# EAGLE design base_backup.1 (EAGLE 6.5.0)
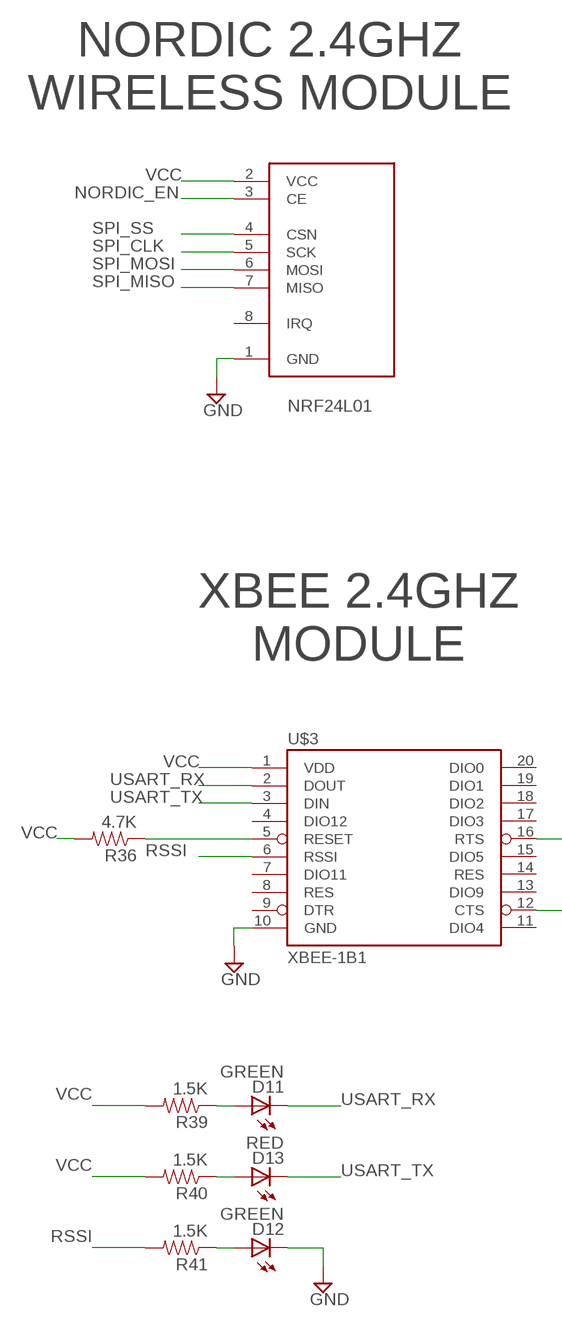
[diagram p0: schematic, sheet 1, part 1 of 2]
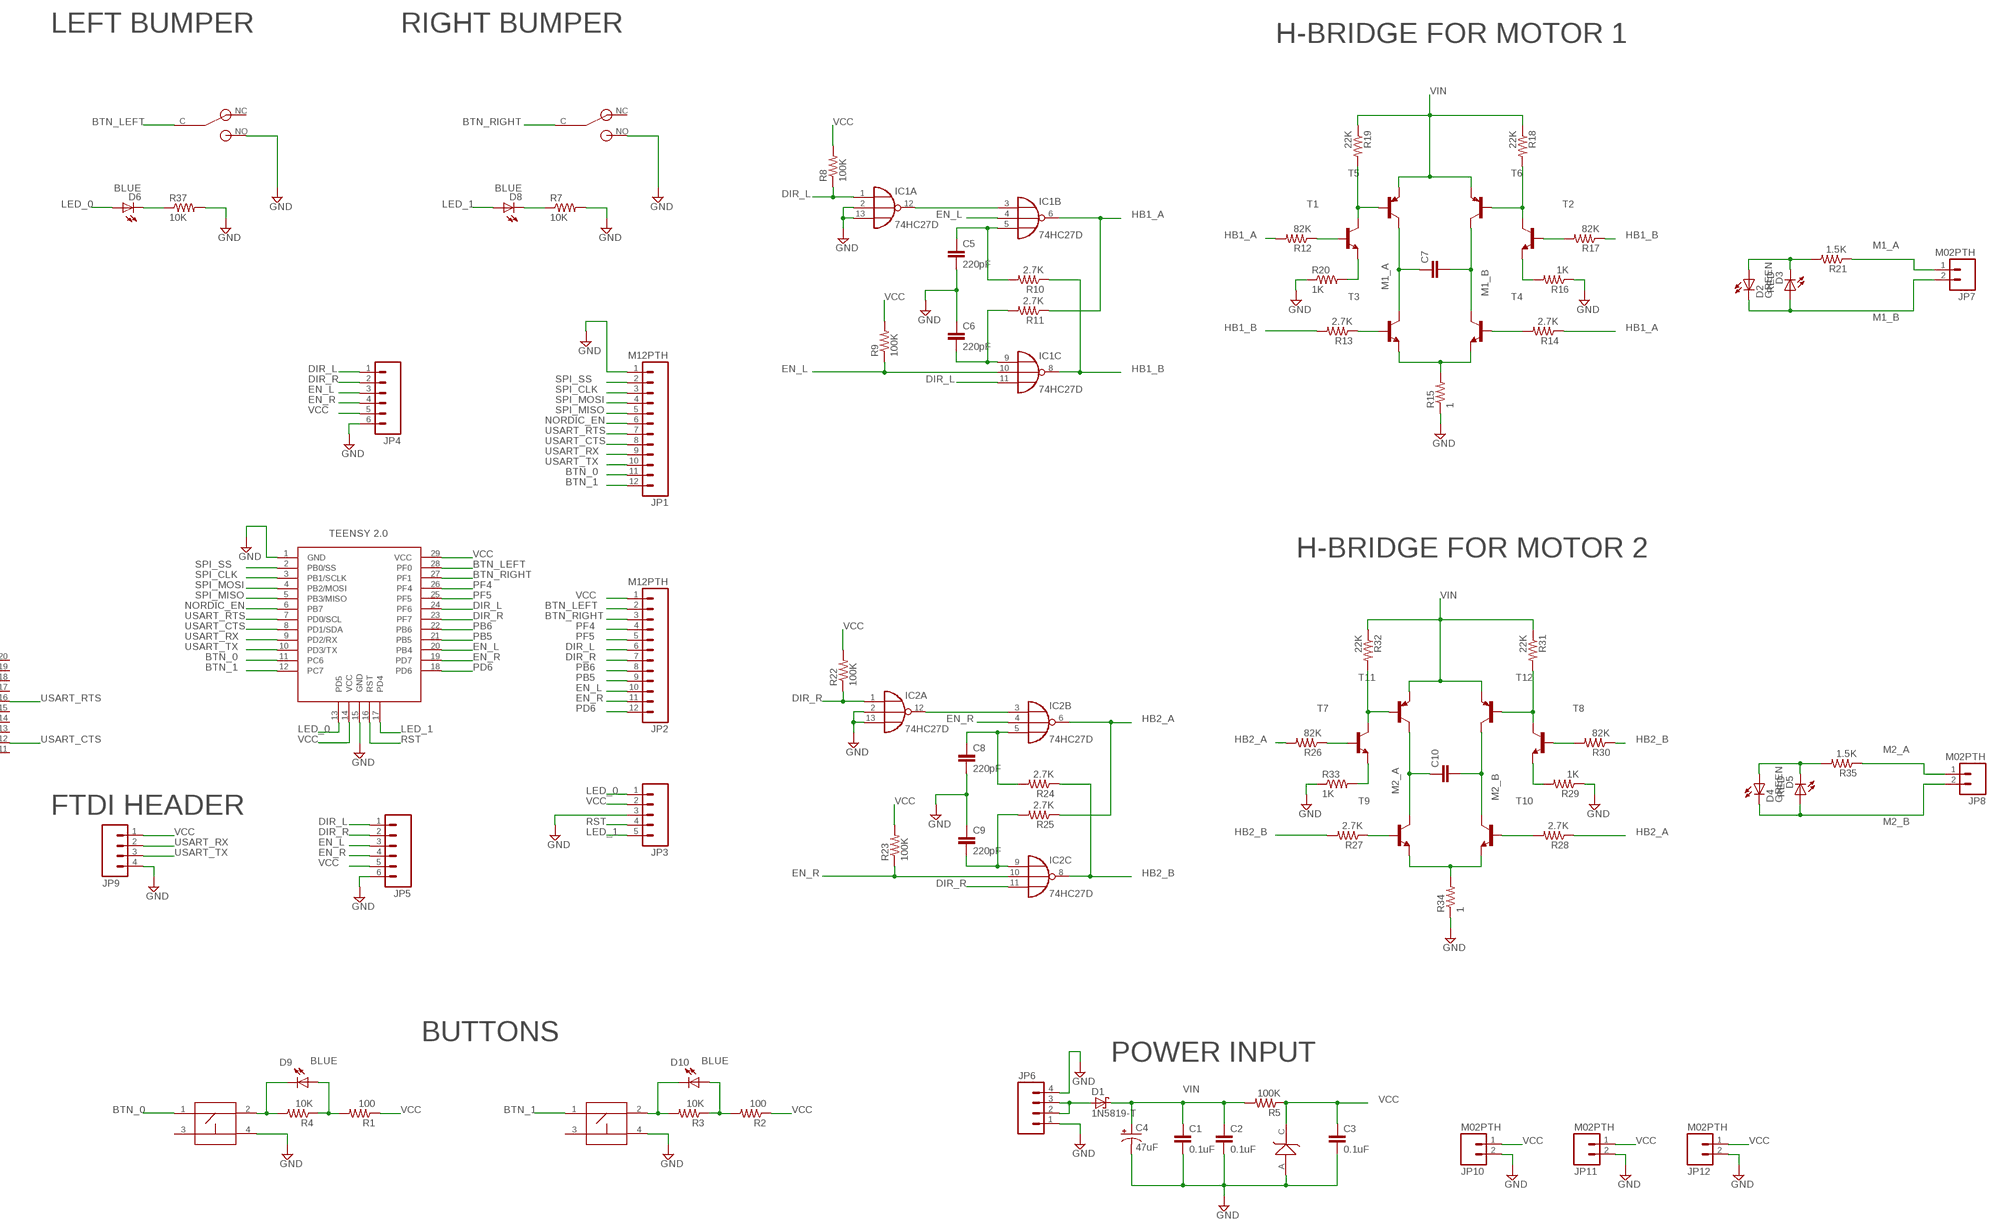
[diagram p1: schematic, sheet 1, part 2 of 2]

## Parts
C1  0.1uF  CAP0603-CAP  [0603-CAP]
C2  0.1uF  CAP0603-CAP  [0603-CAP]
C3  0.1uF  CAP0603-CAP  [0603-CAP]
C4  47uF  CAP_POLC  [PANASONIC_C]
C5  220pF  CAP0603-CAP  [0603-CAP]
C6  220pF  CAP0603-CAP  [0603-CAP]
C7  CAP0603-CAP  [0603-CAP]
C8  220pF  CAP0603-CAP  [0603-CAP]
C9  220pF  CAP0603-CAP  [0603-CAP]
C10  CAP0603-CAP  [0603-CAP]
D1  1N5819-T  [DO41-7.6]
D2  GREEN  LED-GREEN0603  [LED-0603]
D3  RED  LED-RED0603  [LED-0603]
D4  GREEN  LED-GREEN0603  [LED-0603]
D5  RED  LED-RED0603  [LED-0603]
D6  BLUE  LED-BLUE0603  [LED-0603]
D7  1N5819  [DO41-7.6]
D8  BLUE  LED-BLUE0603  [LED-0603]
D9  BLUE  LED-BLUE0603  [LED-0603]
D10  BLUE  LED-BLUE0603  [LED-0603]
D11  GREEN  LED-GREEN0603  [LED-0603]
D12  GREEN  LED-GREEN0603  [LED-0603]
D13  RED  LED-RED0603  [LED-0603]
IC1  74HC27D  [SO14]
IC2  74HC27D  [SO14]
JP1  M12PTH  [1X12]
JP2  M12PTH  [1X12]
JP3  M05PTH  [1X05]
JP4  M06SIP  [1X06]
JP5  M06SIP  [1X06]
JP6  M04PTH  [1X04]
JP7  M02PTH  [1X02]
JP8  M02PTH  [1X02]
JP9  M04PTH  [1X04]
JP10  M02PTH  [1X02]
JP11  M02PTH  [1X02]
JP12  M02PTH  [1X02]
R1  100  RESISTOR0603  [0603-RES]
R2  100  RESISTOR0603  [0603-RES]
R3  10K  RESISTOR0603  [0603-RES]
R4  10K  RESISTOR0603  [0603-RES]
R5  100K  RESISTOR0603  [0603-RES]
R7  10K  RESISTOR0603  [0603-RES]
R8  100K  RESISTOR0603  [0603-RES]
R9  100K  RESISTOR0603  [0603-RES]
R10  2.7K  RESISTOR0603-RES  [0603-RES]
R11  2.7K  RESISTOR0603-RES  [0603-RES]
R12  82K  RESISTOR0603-RES  [0603-RES]
R13  2.7K  RESISTOR0603-RES  [0603-RES]
R14  2.7K  RESISTOR0603-RES  [0603-RES]
R15  1  RESISTOR0603-RES  [0603-RES]
R16  1K  RESISTOR0603-RES  [0603-RES]
R17  82K  RESISTOR0603-RES  [0603-RES]
R18  22K  RESISTOR0603-RES  [0603-RES]
R19  22K  RESISTOR0603-RES  [0603-RES]
R20  1K  RESISTOR0603-RES  [0603-RES]
R21  1.5K  RESISTOR0603-RES  [0603-RES]
R22  100K  RESISTOR0603  [0603-RES]
R23  100K  RESISTOR0603  [0603-RES]
R24  2.7K  RESISTOR0603-RES  [0603-RES]
R25  2.7K  RESISTOR0603-RES  [0603-RES]
R26  82K  RESISTOR0603-RES  [0603-RES]
R27  2.7K  RESISTOR0603-RES  [0603-RES]
R28  2.7K  RESISTOR0603-RES  [0603-RES]
R29  1K  RESISTOR0603-RES  [0603-RES]
R30  82K  RESISTOR0603-RES  [0603-RES]
R31  22K  RESISTOR0603-RES  [0603-RES]
R32  22K  RESISTOR0603-RES  [0603-RES]
R33  1K  RESISTOR0603-RES  [0603-RES]
R34  1  RESISTOR0603-RES  [0603-RES]
R35  1.5K  RESISTOR0603-RES  [0603-RES]
R36  4.7K  RESISTOR0603  [0603-RES]
R37  10K  RESISTOR0603  [0603-RES]
R39  1.5K  RESISTOR0603-RES  [0603-RES]
R40  1.5K  RESISTOR0603-RES  [0603-RES]
R41  1.5K  RESISTOR0603-RES  [0603-RES]
T1  MMBT4401LT1-NPN-SOT23-BEC  [SOT23-BEC]
T2  MMBT4401LT1-NPN-SOT23-BEC  [SOT23-BEC]
T3  MMBT4401LT1-NPN-SOT23-BEC  [SOT23-BEC]
T4  MMBT4401LT1-NPN-SOT23-BEC  [SOT23-BEC]
T5  MMBT4403LT1-PNP-SOT23-BEC  [SOT23-BEC]
T6  MMBT4403LT1-PNP-SOT23-BEC  [SOT23-BEC]
T7  MMBT4401LT1-NPN-SOT23-BEC  [SOT23-BEC]
T8  MMBT4401LT1-NPN-SOT23-BEC  [SOT23-BEC]
T9  MMBT4401LT1-NPN-SOT23-BEC  [SOT23-BEC]
T10  MMBT4401LT1-NPN-SOT23-BEC  [SOT23-BEC]
T11  MMBT4403LT1-PNP-SOT23-BEC  [SOT23-BEC]
T12  MMBT4403LT1-PNP-SOT23-BEC  [SOT23-BEC]
U$1  TEENSY2.0  [TEENSY2.0]
U$2  NRF24L01  [NRF24L01]
U$3  XBEE-1B1  [XBEE-1]
U$4  SPARKFUN_TAC_BUTTONS  [SPARKFUN_TAC_BUTTONS]
U$5  SPARKFUN_TAC_BUTTONS  [SPARKFUN_TAC_BUTTONS]
U$6  SS075Q103F_BTN_RA  [SS075Q103F020V1A]
U$7  SS075Q103F_BTN_RA  [SS075Q103F020V1A]

## Nets
BTN_0: JP1.11 U$1.11(PC6) U$4.1
BTN_1: JP1.12 U$1.12(PC7) U$5.1
BTN_LEFT: JP2.2 U$1.28(PF0) U$6.C(COM)
BTN_RIGHT: JP2.3 U$1.27(PF1) U$7.C(COM)
DIR_L: IC1.1(A:I0) IC1.11(C:I2) JP2.6 JP4.1 JP5.1 R8.1 U$1.24(PF6)
DIR_R: IC2.1(A:I0) IC2.11(C:I2) JP2.7 JP4.2 JP5.2 R22.1 U$1.23(PF7)
EN_L: IC1.4(B:I1) IC1.10(C:I1) JP2.10 JP4.3 JP5.3 R9.1 U$1.20(PB4)
EN_R: IC2.4(B:I1) IC2.10(C:I1) JP2.11 JP4.4 JP5.4 R23.1 U$1.19(PD7)
GND: C1.2 C2.2 C3.2 C4.- C5.2 C6.1 C8.2 C9.1 D7.A D12.C IC1.2(A:I1) IC1.13(A:I2) IC2.2(A:I1) IC2.13(A:I2) JP1.1 JP3.3 JP4.6 JP5.6 JP6.1 JP6.4 JP9.4 JP10.2 JP11.2 JP12.2 R7.2 R15.1 R16.1 R20.1 R29.1 R33.1 R34.1 R37.2 U$1.1(GND) U$1.15(GND) U$2.1(GND) U$3.10(GND) U$4.4 U$5.4 U$6.NO U$7.NO
HB1_A: IC1.6(B:O) R11.1 R12.2 R14.1
HB1_B: IC1.8(C:O) R10.1 R13.2 R17.1
HB2_A: IC2.6(B:O) R25.1 R26.2 R28.1
HB2_B: IC2.8(C:O) R24.1 R27.2 R30.1
LED_0: D6.A JP3.1 U$1.13(PD5)
LED_1: D8.A JP3.5 U$1.17(PD4)
M1_A: C7.1 JP7.1 R21.1 T3.C T5.C
M1_B: C7.2 D2.C D3.A JP7.2 T4.C T6.C
M2_A: C10.1 JP8.1 R35.1 T9.C T11.C
M2_B: C10.2 D4.C D5.A JP8.2 T10.C T12.C
N$1: IC2.3(B:I0) IC2.12(A:O)
N$2: C8.1 IC2.5(B:I2) R24.2
N$3: D9.A R1.2 R4.1
N$4: D9.C R4.2 U$4.2
N$5: C9.2 IC2.9(C:I0) R25.2
N$6: D10.A R2.2 R3.1
N$7: D10.C R3.2 U$5.2
N$8: R27.1 T9.B
N$9: R32.2 T7.C T11.B
N$10: R31.2 T8.C T12.B
N$11: D1.A JP6.2 JP6.3
N$12: D6.C R37.1
N$14: D12.A R41.1
N$15: D13.A R40.1
N$16: D11.A R39.1
N$17: R30.2 T8.B
N$18: C6.2 IC1.9(C:I0) R11.2
N$19: IC1.3(B:I0) IC1.12(A:O)
N$20: R26.1 T7.B
N$21: C5.1 IC1.5(B:I2) R10.2
N$22: R19.2 T1.C T5.B
N$23: R28.2 T10.B
N$24: R20.2 T1.E
N$25: R34.2 T9.E T10.E
N$26: R33.2 T7.E
N$27: R29.2 T8.E
N$28: D4.A D5.C R35.2
N$29: R18.2 T2.C T6.B
N$30: R17.2 T2.B
N$32: R13.1 T3.B
N$33: R12.1 T1.B
N$34: D8.C R7.1
N$36: R14.2 T4.B
N$37: R15.2 T3.E T4.E
N$38: R16.2 T2.E
N$44: D2.A D3.C R21.2
N$46: R36.1 U$3.5(RESET)
NORDIC_EN: JP1.6 U$1.6(PB7) U$2.3(CE)
PB5: JP2.9 U$1.21(PB5)
PB6: JP2.8 U$1.22(PB6)
PD6: JP2.12 U$1.18(PD6)
PF4: JP2.4 U$1.26(PF4)
PF5: JP2.5 U$1.25(PF5)
RSSI: R41.2 U$3.6(RSSI)
RST: JP3.4 U$1.16(RST)
SPI_CLK: JP1.3 U$1.3(PB1/SCLK) U$2.5(SCK)
SPI_MISO: JP1.5 U$1.5(PB3/MISO) U$2.7(MISO)
SPI_MOSI: JP1.4 U$1.4(PB2/MOSI) U$2.6(MOSI)
SPI_SS: JP1.2 U$1.2(PB0/SS) U$2.4(CSN)
USART_CTS: JP1.8 U$1.8(PD1/SDA) U$3.12(CTS)
USART_RTS: JP1.7 U$1.7(PD0/SCL) U$3.16(RTS)
USART_RX: D11.C JP1.9 JP9.2 U$1.9(PD2/RX) U$3.2(DOUT)
USART_TX: D13.C JP1.10 JP9.3 U$1.10(PD3/TX) U$3.3(DIN)
VCC: C3.1 D7.C JP2.1 JP3.2 JP4.5 JP5.5 JP9.1 JP10.1 JP11.1 JP12.1 R1.1 R2.1 R5.1 R8.2 R9.2 R22.2 R23.2 R36.2 R39.2 R40.2 U$1.14(VCC) U$1.29(VCC) U$2.2(VCC) U$3.1(VDD)
VIN [VIN]: C1.1 C2.1 C4.+ D1.C R5.2 R18.1 R19.1 R31.1 R32.1 T5.E T6.E T11.E T12.E
Unconnected: U$2.8(IRQ) U$3.4(DIO12) U$3.7(DIO11) U$3.8(RES) U$3.9(DTR) U$3.11(DIO4) U$3.13(DIO9) U$3.14(RES) U$3.15(DIO5) U$3.17(DIO3) U$3.18(DIO2) U$3.19(DIO1) U$3.20(DIO0) U$4.3 U$5.3 U$6.NC U$7.NC

## Notes on the sheet
- LEFT BUMPER | RIGHT BUMPER
- H-BRIDGE FOR MOTOR 1
- NORDIC 2.4GHZ
  WIRELESS MODULE
- H-BRIDGE FOR MOTOR 2
- XBEE 2.4GHZ
  MODULE
- FTDI HEADER
- BUTTONS
- POWER INPUT

## Power pins joined to a net without a drawn wire
GND: IC1.7(P:GND) IC2.7(P:GND)
VCC: IC1.14(P:VCC) IC2.14(P:VCC)

## Library data of the parts
C1-C3 C5-C10 = SparkFun-Capacitors:CAP: Capacitor Standard 0603 ceramic capacitor, and 0.1" leaded capacitor.
C4 = SparkFun-Capacitors:CAP_POL: Capacitor Polarized These are standard SMD and PTH capacitors. Normally 10uF, 47uF, and 100uF in electrolytic and tantalum varieties. Always verify the external diameter of the through hole cap, it varies with capacity, voltage, and manufacturer. The EIA devices should be standard.
D1 = diode:1N581*: 1.0A SCHOTTKY BARRIER RECTIFIER Source: http://www.diodes.com/datasheets/ds23001.pdf
D2 D4 D11 D12 = SparkFun-LED:LED-GREEN: Various green LEDs 0603- DIO-00821 LARGE- DIO-00862 LILYPAD- DIO-09910; PROD_ID: DIO-00821
D3 D5 D13 = SparkFun-LED:LED-RED: Assorted Red LEDs LilyPad 1206- DIO-09912 1206- DIO-00809 0603- DIO-00819; PROD_ID: DIO-00819
D6 D8-D10 = SparkFun-LED:LED-BLUE: Blue LEDs for production use Various blue LEDs stocked by SparkFun production 0603 - DIO-08575 Rebel - DIO-09553 1206 - DIO-09911; PROD_ID: DIO-08575
D7 = TuansLib:1N5819; MANUFACTURER: 1N4728ATR
IC1 IC2 = 74xx-eu:74*27: Triple 3-input NOR gate
JP1 JP2 = SparkFun-Connectors:M12: Header 12 Standard 12-pin 0.1" header. Use with straight break away headers (SKU : PRT-00116), right angle break away headers (PRT-00553), swiss pins (PRT-00743), machine pins (PRT-00117), and female headers (PRT-00115).
JP3 = SparkFun-Connectors:M05: Header 5 Standard 5-pin 0.1" header. Use with straight break away headers (SKU : PRT-00116), right angle break away headers (PRT-00553), swiss pins (PRT-00743), machine pins (PRT-00117), and female headers (PRT-00115). Molex polarized connector foot print use with SKU : PRT-08230 with associated crimp pins and housings.
JP4 JP5 = SparkFun-Connectors:M06: Header 6 Standard 6-pin 0.1" header. Use with straight break away headers (SKU : PRT-00116), right angle break away headers (PRT-00553), swiss pins (PRT-00743), machine pins (PRT-00117), and female headers (PRT-00115). Molex polarized connector foot print use with SKU : PRT-08094 with associated crimp pins and housings. NOTES ON THE VARIANTS LOCK and LOCK_LONGPADS... This footprint was designed to help hold the alignment of a through-hole component (i.e. 6-pin header) while soldering it into place. You may notice that each hole has been shifted either up or down by 0.005 of an inch from it's more standard position (which is a perfectly straight line). This slight alteration caused the pins (the squares in the middle) to touch the edges of the holes. Because they are alternating, it causes a "brace" to hold the component in place. 0.005 has proven to be the perfect amount of "off-center" position when using our standard breakaway headers. Although looks a little odd when you look at the bare footprint, once you have a header in there, the alteration is very hard to notice. Also,if you push a header all the way into place, it is covered up entirely on the bottom side. This idea of altering the position of holes to aid alignment will be further integrated into the Sparkfun Library for other footprints. It can help hold any component with 3 or more connection pins.
JP6 JP9 = SparkFun-Connectors:M04: Header 4 Standard 4-pin 0.1" header. Use with straight break away headers (SKU : PRT-00116), right angle break away headers (PRT-00553), swiss pins (PRT-00743), machine pins (PRT-00117), and female headers (PRT-00115). Molex polarized connector foot print use with SKU : PRT-08231 with associated crimp pins and housings. 1MM SMD Version SKU: PRT-10208
JP7 JP8 JP10-JP12 = SparkFun-Connectors:M02: Standard 2-pin 0.1" header. Use with - straight break away headers ( PRT-00116) - right angle break away headers (PRT-00553) - swiss pins (PRT-00743) - machine pins (PRT-00117) - female headers (PRT-00115) Molex polarized connector foot print use with: PRT-08233 with associated crimp pins and housings. 2.54_SCREWTERM for use with PRT-10571. 3.5mm Screw Terminal footprints for PRT-08084 5mm Screw Terminal footprints for use with PRT-08433
R1-R5 R7-R37 R39-R41 = SparkFun-Resistors:RESISTOR: Resistor Basic schematic elements and footprints for 0603, 1206, and PTH resistors.
T1-T4 T7-T10 = transistor:*-NPN-: NPN Transistror BF959 corrected 2008.03.06
T5 T6 T11 T12 = transistor:*-PNP-: PNP Transistror
U$1 = TuansLib:TEENSY2.0
U$2 = TuansLib:NRF24L01
U$3 = SparkFun-RF:XBEE-1: Xbee module footprints SMT header is CONN-09042.
U$4 U$5 = TuansLib:SPARKFUN_TAC_BUTTONS
U$6 U$7 = TuansLib:SS075Q103F_BTN_RA

## Net classes
1 VIN: width 0.254 mm

## Board
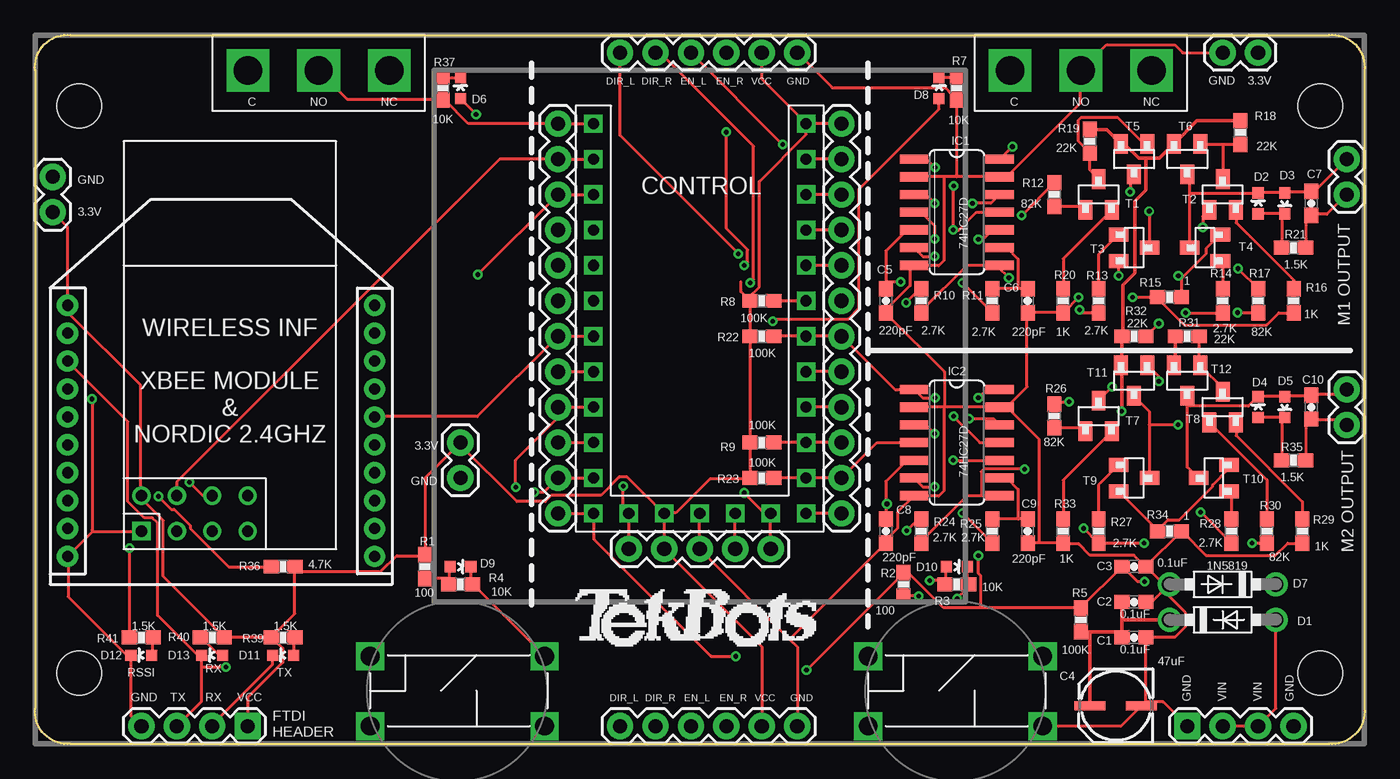
[diagram p2: board, top side]
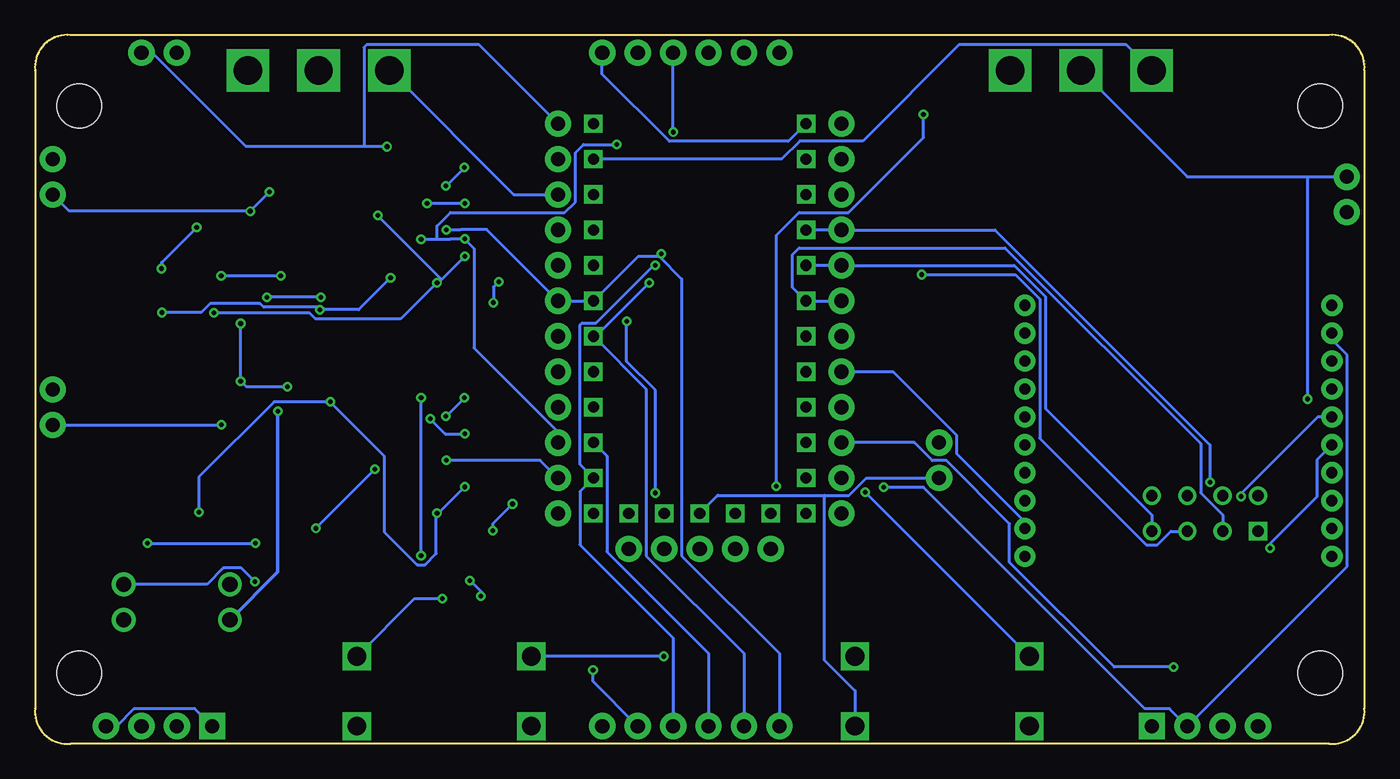
[diagram p3: board, bottom side, seen from below]

Size 95.27 x 50.82 mm. Coordinates in mm from the lower left corner, seen from the top.
Outline: 0.01,48.27 arc-100 2.55,50.81 92.72,50.81 arc-100 95.26,48.27 95.26,2.55 arc-100 92.72,0.01 2.55,0.01 arc-100 0.01,2.55 0.01,48.27
Copper layers (1*16): Top 0.035mm / dielectric 1.5mm / Bottom 0.035mm
Design rules "default *": minimum track width 8mil, minimum drill 13mil, track to track 8mil, track to pad 8mil, pad to pad 8mil, via to via 8mil, smd to smd 8mil, copper to edge 10mil, drill to drill 8mil, minimum pad ring 10mil, minimum via ring 7mil, stop-mask expansion 4mil, vias tented up to drill 0mil, thermal gap 10mil
Holes 3.17 mm at 3.18,45.73 3.18,5.09 92.08,5.09 92.08,45.73

### Footprints (pad centres in the part's own frame; a part is rotated, then mirrored left to right if it is on the bottom)
0603-CAP = smd 1.1 x 1: 1 -0.85,0; 2 0.85,0
PANASONIC_C = smd 2.2 x 0.65: + 1.9,-0.2; - -1.8,-0.2
DO41-7.6 = drill 1.1 pad 1.7: A 3.81,0; C -3.81,0
LED-0603 = smd 0.8 x 0.8: A 0,-0.75; C 0,0.75
SO14 = smd 0.66 x 2.032: 1 -3.81,-3.073; 2 -2.54,-3.073; 3 -1.27,-3.073; 4 0,-3.073; 5 1.27,-3.073; 6 2.54,-3.073; 7 3.81,-3.073; 8 3.81,3.073; 9 2.54,3.073; 10 1.27,3.073; 11 0,3.073; 12 -1.27,3.073; 13 -2.54,3.073; 14 -3.81,3.073
1X12 = drill 1.016 pad 1.88: 1 0,0; 2 2.54,0; 3 5.08,0; 4 7.62,0; 5 10.16,0; 6 12.7,0; 7 15.24,0; 8 17.78,0; 9 20.32,0; 10 22.86,0; 11 25.4,0; 12 27.94,0
1X05 = drill 1.016 pad 1.88: 1 0,0; 2 2.54,0; 3 5.08,0; 4 7.62,0; 5 10.16,0
1X06 = drill 1.016 pad 1.88: 1 0,0; 2 2.54,0; 3 5.08,0; 4 7.62,0; 5 10.16,0; 6 12.7,0
1X04 = drill 1.016 pad 1.88 square: 1 0,0 | drill 1.016 pad 1.88: 2 2.54,0; 3 5.08,0; 4 7.62,0
1X02 = drill 1.016 pad 1.88: 1 0,0; 2 2.54,0
0603-RES = smd 1.1 x 1: 1 -0.85,0; 2 0.85,0
SOT23-BEC = smd 1 x 1.4: B -0.95,-1.1; C 0,1.1; E 0.95,-1.1
TEENSY2.0 = drill 0.8 square: 1 -7.62,15.24; 2 -7.62,12.7; 3 -7.62,10.16; 4 -7.62,7.62; 5 -7.62,5.08; 6 -7.62,2.54; 7 -7.62,0; 8 -7.62,-2.54; 9 -7.62,-5.08; 10 -7.62,-7.62; 11 -7.62,-10.16; 12 -7.62,-12.7; 13 -5.08,-12.7; 14 -2.54,-12.7; 15 0,-12.7; 16 2.54,-12.7; 17 5.08,-12.7; 18 7.62,-12.7; 19 7.62,-10.16; 20 7.62,-7.62; 21 7.62,-5.08; 22 7.62,-2.54; 23 7.62,0; 24 7.62,2.54; 25 7.62,5.08; 26 7.62,7.62; 27 7.62,10.16; 28 7.62,12.7; 29 7.62,15.24
NRF24L01 = drill 0.8 square: 1 1.27,1.27 | drill 0.8: 2 1.27,3.81; 3 3.81,1.27; 4 3.81,3.81; 5 6.35,1.27; 6 6.35,3.81; 7 8.89,1.27; 8 8.89,3.81
XBEE-1 = drill 0.8 pad 1.524: 1 -11,20; 2 -11,18; 3 -11,16; 4 -11,14; 5 -11,12; 6 -11,10; 7 -11,8; 8 -11,6; 9 -11,4; 10 -11,2; 11 11,2; 12 11,4; 13 11,6; 14 11,8; 15 11,10; 16 11,12; 17 11,14; 18 11,16; 19 11,18; 20 11,20
SPARKFUN_TAC_BUTTONS = drill 1.346 square: 1 0,5.004; 2 12.497,5.004; 3 0,0; 4 12.497,0
SS075Q103F020V1A = drill 2.032 square: C 0,0; NC 10.16,0; NO 5.08,0

### Placement (x,y rotation side)
C1  78.75,7.63 0 top
C2  78.75,10.17 0 top
C3  78.75,12.71 0 top
C4  77.48,2.55 180 top
C5  60.97,31.76 270 top
C6  71.13,31.76 90 top
C7  91.45,38.74 90 top
C8  60.97,15.25 270 top
C9  71.13,15.25 90 top
C10  91.45,24.14 90 top
D1  85.1,8.9 0 top
D2  87.64,38.74 0 top
D3  89.54,38.74 180 top
D4  87.64,24.14 0 top
D5  89.54,24.14 180 top
D6  30.49,47 0 top
D7  85.1,11.44 180 top
D8  64.78,47 0 top
D9  30.49,12.71 270 top
D10  66.05,12.71 270 top
D11  17.79,6.36 90 top
D12  7.63,6.36 90 top
D13  12.71,6.36 90 top
IC1  66.05,38.11 270 top
IC2  66.05,21.6 270 top
JP1  37.47,44.46 270 top
JP2  57.79,44.46 270 top
JP3  42.55,13.98 0 top
JP4  41.92,1.28 0 top
JP5  41.92,49.54 0 top
JP6  82.56,1.28 0 top
JP7  93.99,39.38 90 top
JP8  93.99,22.87 90 top
JP9  15.25,1.28 180 top
JP10  1.28,38.11 90 top
JP11  87.64,49.54 180 top
JP12  30.49,21.6 270 top
R1  27.95,12.71 270 top
R2  62.24,11.44 270 top
R3  66.05,11.44 0 top
R4  30.49,11.44 0 top
R5  74.94,8.9 270 top
R7  66.05,47 270 top
R8  52.08,31.76 180 top
R9  52.08,21.6 180 top
R10  63.51,31.76 90 top
R11  68.59,31.76 90 top
R12  73.03,39.38 90 top
R13  76.21,31.76 270 top
R14  85.1,31.76 90 top
R15  81.29,32.01 0 top
R16  90.18,31.76 90 top
R17  87.64,31.76 90 top
R18  86.37,43.82 270 top
R19  75.57,43.19 270 top
R20  73.67,31.76 90 top
R21  90.18,35.57 180 top
R22  52.08,29.22 180 top
R23  52.08,19.06 180 top
R24  63.51,15.25 90 top
R25  68.59,15.25 90 top
R26  73.03,23.5 90 top
R27  76.21,15.25 270 top
R28  85.73,15.25 90 top
R29  90.81,15.25 90 top
R30  88.27,15.25 90 top
R31  82.56,29.22 0 top
R32  78.75,29.22 0 top
R33  73.67,15.25 90 top
R34  81.29,15.25 180 top
R35  90.18,20.33 180 top
R36  17.79,12.71 0 top
R37  29.22,47 270 top
R39  17.79,7.63 180 top
R40  12.71,7.63 0 top
R41  7.63,7.63 180 top
T1  76.21,39.38 0 top
T2  85.1,39.38 0 top
T3  78.75,35.57 270 top
T4  83.83,35.57 90 top
T5  78.75,41.92 180 top
T6  82.56,41.92 180 top
T7  76.21,23.5 0 top
T8  85.1,24.14 0 top
T9  78.75,19.06 270 top
T10  84.46,19.06 90 top
T11  78.75,26.04 180 top
T12  82.56,26.04 180 top
U$1  47.63,29.22 0 top
U$2  6.36,13.98 0 top
U$3  13.34,11.44 0 top
U$4  24.01,1.28 0 top
U$5  59.7,1.28 0 top
U$6  15.25,48.27 0 top
U$7  69.86,48.27 0 top

### Tracks (layer width: path | path; a pad name or v marks a point on that pad's centre or on a via)
BTN_0  (via drill 0.33)
  Top 0.203: U$1.11 JP1.11 37.4,19.01 36.43,18.04 v35.77,18.04
  Bottom 0.203: v35.77,18.04 U$4.1
BTN_1  (via drill 0.33)
  Top 0.203: v50.2,6.28 48.47,6.28 48.4,6.33 40.06,14.66 40.06,16.44 U$1.12 JP1.12
  Bottom 0.203: v50.2,6.28 U$5.1
BTN_LEFT
  Top 0.203: JP2.2 U$1.28
  Bottom 0.203: U$1.28 41.77,41.92 40.47,43.21 35.95,43.21 29.07,50.1 17.08,50.1 U$6.C
BTN_RIGHT
  Top 0.203: JP2.3 U$1.27
  Bottom 0.203: JP2.3 60.97,39.38 U$7.C
DIR_L  (via drill 0.33)
  Top 0.203: U$1.24 R8.1 | IC1.11 67.47,38.11 66.2,36.84 v65.79,36.84 65.82,36.91 v65.82,39.99 | IC1.1 63.89,41.92 v64.5,41.31 | JP5.1 41.92,43.62 v50.4,35.14
  Bottom 0.203: v65.79,36.84 64.78,36.84 64.75,36.86 62.9,36.86 JP2.6 U$1.24 55.18,31.81 52.03,34.96 50.55,34.96 | v65.82,39.99 v64.5,41.31 | JP4.1 41.92,6.49 48.93,13.5 48.93,33.33 50.55,34.96 | v50.4,35.14 50.5,35.04 50.55,34.96
DIR_R  (via drill 0.33)
  Top 0.203: R22.1 U$1.23 JP2.7 61.6,25.41 IC2.1 63.05,25.36 63.61,24.8 v64.5,24.8 | IC2.11 67.7,21.6 v65.82,23.48 | JP5.2 44.79,49.54 51.49,42.83 51.49,33.31 v51.24,33.05
  Bottom 0.203: v64.5,24.8 v65.82,23.48 | JP4.2 44.46,6.49 51.47,13.5 51.47,25.43 U$1.23 55.1,29.19 v51.24,33.05
EN_L  (via drill 0.33)
  Top 0.203: R9.1 U$1.20 JP2.10 | IC1.4 63.48,38.11 64.47,37.12 v64.47,36.2 | v67.6,36.18 67.95,36.18 68.61,36.84 IC1.10 | v53.58,42.96 JP5.3
  Bottom 0.203: JP4.3 47,6.49 54.29,13.78 54.29,20.63 U$1.20 | v67.6,36.18 66.45,36.18 | 66.45,36.18 65.52,36.18 65.49,36.2 v64.47,36.2 64.42,36.13 63.81,35.52 63.81,28.38 57.79,22.36 JP2.10 | v53.58,42.96 55.96,42.96 56.55,42.38 56.55,38.85 57.31,38.08 65.49,38.08 66.45,37.12 66.45,36.18
EN_R  (via drill 0.33)
  Top 0.203: R23.1 U$1.19 JP2.11 60.33,21.6 IC2.4 | v65.79,20.33 IC2.10 | v49.54,43.85 49.54,36.94 51.06,35.42 51.06,34.53 v50.83,34.3
  Bottom 0.203: v65.79,20.33 59.06,20.33 JP2.11 | JP4.4 49.54,7.6 56.22,14.28 56.22,18.09 U$1.19 55.3,19.13 56.22,20.05 56.22,30.01 56.04,30.18 55.08,30.18 50.96,34.3 v50.83,34.3 | v49.54,43.85 JP5.4
GND  (via drill 0.33)
  Top 0.203: U$1.15 JP3.3 47.68,13.9 54.07,7.51 | JP4.6 54.62,6.97 54.07,7.51 | 71.94,14.41 73.67,14.41 R33.1 73.74,14.33 74.79,14.33 75.6,13.52 78.75,13.52 79.51,12.76 C3.2 | 71.94,14.41 71.13,14.41 C9.1 | C2.2 80.02,10.17 D7.A | C3.2 79.61,12.71 81.03,11.29 D7.A | C3.2 79.66,12.78 82.13,15.25 R34.1 82.23,15.2 83.9,13.52 88.88,13.52 89.75,14.38 90.81,14.38 R29.1 | C4.- 79.59,3.06 79.59,7.63 C1.2 79.69,7.68 81.72,7.68 82.46,8.42 82.46,9.38 80.91,10.93 D7.A | JP6.1 80.83,3.01 79.66,3.01 C4.- | U$5.4 77.81,1.28 79.21,2.68 C4.- | R16.1 90.18,30.89 89.11,30.89 88.25,30.03 82.36,30.03 80.45,31.94 80.45,32.01 R15.1 v78.65,32.01 | IC2.13 69.63,24.14 71.08,25.59 71.08,30.82 C6.1 71.13,30.92 73.67,30.92 R20.1 73.74,30.97 v74.79,32.01 | IC2.13 65.16,24.14 | 65.16,24.14 65.13,24.14 | 65.13,24.14 IC2.2 | 65.13,24.14 65.13,18.14 64.75,17.76 63.05,17.76 IC2.7 61.81,16.62 61.81,15.45 60.97,14.61 C8.2 60.89,14.33 54.07,7.51 | 71.94,14.41 71.94,21.85 69.71,24.09 IC2.13 | JP11.2 82.23,49.54 81.67,50.1 76.77,50.1 U$7.NO 74.89,48.19 74.89,45.91 69.68,40.7 69.2,40.7 IC1.13 66.05,40.65 | 66.05,40.65 65.13,40.65 | 65.13,40.65 IC1.2 | 65.13,40.65 65.13,34.65 64.75,34.27 63.05,34.27 IC1.7 62.7,34.02 62.7,32.85 60.97,31.12 C5.2 61.02,30.82 65.16,26.68 65.16,24.14 | JP9.4 6.89,2.02 6.89,6.36 D12.C 6.79,6.41 6.51,6.41 2.37,10.55 2.37,13.34 U$3.10 4.15,15.25 | 4.15,15.25 U$2.1 | U$1.1 JP1.1 31.05,44.46 29.37,46.13 29.22,46.13 R37.2 29.14,46.21 22.39,46.21 U$6.NO | v4.1,24.72 4.1,15.32 4.15,15.25 | 66.05,40.65 R7.2 66,46.24 65.49,46.74 65.49,46.77 65.24,47.02 57.13,47.02 JP5.6
  Bottom 0.203: U$1.15 46.39,17.76 46.31,17.81 38.72,17.81 | JP6.4 89.42,1.28 88.17,2.52 83.8,2.52 JP6.1 | v74.79,32.01 v78.65,32.01 | JP12.2 35.7,19.06 36.94,17.81 38.72,17.81 | U$4.4 36.51,3.82 38.72,6.03 38.72,17.81 | 4.1,40.65 12.71,40.65 U$6.NO | 4.1,40.65 JP10.2 | 4.1,40.65 v4.1,24.72 | JP5.6 54.62,47.99 49.82,43.19 41.28,43.19 U$1.1
HB1_A  (via drill 0.33)
  Top 0.203: v66.45,33.05 68.59,30.92 R11.1 | v64.47,34.93 63.61,34.93 IC1.6 | v82.43,30.89 85.1,30.89 R14.1 | v70.7,37.88 73.03,40.22 R12.2
  Bottom 0.203: v64.47,34.93 66.11,33.3 | 66.11,33.3 66.35,33.05 v66.45,33.05 66.53,33 69.07,30.46 75.17,30.46 75.6,30.89 v82.43,30.89 | 66.11,33.3 v70.7,37.88
HB1_B  (via drill 0.33)
  Top 0.203: R10.1 63.51,31.05 66.76,34.3 IC1.8 68.97,34.22 v69.78,33.41 | v74.84,31.12 75.04,30.92 76.21,30.92 R13.2 | v86.17,30.92 87.64,30.92 R17.1
  Bottom 0.203: v69.78,33.41 72.07,31.12 v74.84,31.12 74.91,31.17 75.04,31.3 78.88,31.3 79.13,31.56 82.71,31.56 83.35,30.92 v86.17,30.92
HB2_A  (via drill 0.33)
  Top 0.203: v66.45,16.54 68.59,14.41 R25.1 | v64.47,18.42 63.61,18.42 IC2.6 | v83.52,16.62 85.73,14.41 R28.1 | v74.1,24.52 73.19,24.52 R26.2
  Bottom 0.203: v64.47,18.42 66.35,16.54 v66.45,16.54 66.51,16.47 66.51,13.65 67.32,12.84 67.88,12.84 70.24,15.2 70.24,20.63 74.05,24.44 v74.1,24.52 78.14,24.52 83.52,19.13 v83.52,16.62
HB2_B  (via drill 0.33)
  Top 0.203: R24.1 63.51,14.54 66.76,17.79 67.8,17.79 | IC2.8 67.8,17.79 | v79.46,14.38 76.21,14.38 R27.2 76.13,14.46 v75.14,15.45 | v87.21,14.38 88.27,14.38 R30.1 | 67.8,17.79 67.8,19.52 67.98,19.69 v70.9,19.69
  Bottom 0.203: v87.21,14.38 v79.46,14.38 | v75.14,15.45 v70.9,19.69
LED_0  (via drill 0.33)
  Top 0.203: JP3.1 U$1.13 42.5,16.59 42.15,16.95 v42.15,18.47 | v31.61,45.12 30.49,46.24 D6.A
  Bottom 0.203: v31.61,45.12 31.61,43.47 36.99,38.08 40.52,38.08 42.15,36.46 v42.15,18.47
LED_1  (via drill 0.33)
  Top 0.203: JP3.5 U$1.17 52.64,16.16 v50.81,17.99 | D8.A 64.78,45.5 59.04,39.76 59.04,31.23 58.28,30.46 53.04,30.46 v52.87,30.29
  Bottom 0.203: v52.87,30.29 52.87,27.42 50.81,25.36 v50.81,17.99
M1_A  (via drill 0.33)
  Top 0.203: v79.84,38.18 T3.C | v78.47,39.56 78.47,40.52 78.75,40.8 T5.C | R21.1 91.04,35.57 91.04,37.47 C7.1 91.52,37.96 92.57,37.96 JP7.1
  Bottom 0.203: v78.47,39.56 v79.84,38.18 79.92,38.24 92.85,38.24 JP7.1
M1_B
  Top 0.203: 82.71,39.43 82.71,40.65 82.56,40.8 T6.C | 82.71,39.43 82.71,35.57 T4.C | JP7.2 91.73,39.66 91.52,39.66 C7.2 91.45,39.58 89.59,39.58 D3.A 89.54,39.51 87.64,39.51 D2.C 87.56,39.43 82.71,39.43
M2_A  (via drill 0.33)
  Top 0.203: 79.84,22.87 79.84,23.83 78.75,24.93 T11.C | 79.84,22.87 T9.C | R35.1 91.04,20.33 91.04,22.87 91.45,23.27 C10.1 91.52,23.22 93.63,23.22 JP8.1 | v81.9,22.87 79.84,22.87
  Bottom 0.203: JP8.1 v81.9,22.87
M2_B
  Top 0.203: 82.56,24.21 82.56,19.85 83.35,19.06 T10.C | 82.56,24.21 T12.C | JP8.2 93.63,25.05 91.52,25.05 C10.2 91.45,24.98 89.59,24.98 D5.A 89.54,24.9 87.64,24.9 D4.C 87.56,24.82 86.95,24.21 82.56,24.21
N$1  (via drill 0.33)
  Top 0.203: IC2.3 63.84,22.87 v64.47,22.23 | v66.94,23.3 68.69,23.3 IC2.12
  Bottom 0.203: v64.47,22.23 65.87,22.23 v66.94,23.3
N$2  (via drill 0.33)
  Top 0.203: 60.97,17.2 60.97,18.83 62.47,20.33 IC2.5 | 60.97,17.2 C8.1 | v62.47,15.3 63.25,16.09 63.51,16.09 R24.2 | v61.04,17.2 60.97,17.2
  Bottom 0.203: v62.47,15.3 62.47,15.78 v61.04,17.2
N$3
  Top 0.203: D9.A 29.73,12.71 29.73,11.51 29.65,11.44 R4.1 29.65,11.87 27.95,11.87 R1.2
N$4
  Top 0.203: D9.C 31.25,12.71 31.25,11.51 31.33,11.44 R4.2 31.43,11.39 36.51,6.31 U$4.2
N$5
  Top 0.203: 70.44,16.11 71.13,16.11 C9.2 | 70.44,16.11 68.59,16.11 R25.2 | 70.44,16.11 70.44,18.25 69.63,19.06 IC2.9
N$6  (via drill 0.33)
  Top 0.203: D10.A 65.29,12.71 65.29,11.51 65.21,11.44 R3.1 65.21,11.72 v64.09,11.72 | v63.31,10.6 62.24,10.6 R2.2
  Bottom 0.203: v63.31,10.6 63.31,10.93 v64.09,11.72
N$7  (via drill 0.33)
  Top 0.203: D10.C 66.81,12.71 66.81,11.51 66.89,11.44 R3.2 66.84,11.36 66.84,11.18 v66.07,10.42
  Bottom 0.203: v66.07,10.42 68.06,10.42 U$5.2
N$8
  Top 0.203: R27.1 76.21,18.58 77.63,20 T9.B
N$9  (via drill 0.33)
  Top 0.203: v80.53,30.13 79.61,29.22 R32.2 | v80.53,25.99 80.53,26.32 79.71,27.14 T11.B | v77.17,25.61 77.17,25.59 76.21,24.62 T7.C
  Bottom 0.203: v80.53,30.13 v80.53,25.99 80.45,25.94 80.12,25.61 v77.17,25.61
N$10
  Top 0.203: R31.2 83.42,29.22 83.42,27.24 83.5,27.16 T12.B 83.55,27.06 85.1,25.51 T8.C
N$11
  Top 0.203: D1.A 88.91,2.55 JP6.3 JP6.2
N$12
  Top 0.203: D6.C 30.49,47.76 29.29,47.76 29.22,47.84 R37.1
N$14
  Top 0.203: D12.A 8.39,6.36 8.39,7.55 8.47,7.63 R41.1
N$15
  Top 0.203: D13.A 13.19,6.36 11.92,7.63 R40.1
N$16
  Top 0.203: D11.A 18.55,6.36 18.55,7.55 18.63,7.63 R39.1
N$17
  Top 0.203: R30.2 88.27,18.93 T8.B
N$18
  Top 0.203: 70.44,32.62 71.13,32.62 C6.2 | 70.44,32.62 68.59,32.62 R11.2 | 70.44,32.62 70.44,34.76 69.63,35.57 IC1.9
N$19  (via drill 0.33)
  Top 0.203: IC1.3 63.84,39.38 v64.47,38.74 | v67.17,38.74 68.49,38.74 IC1.12
  Bottom 0.203: v67.17,38.74 v64.47,38.74
N$20
  Top 0.203: R26.1 75.01,22.64 75.24,22.41 T7.B
N$21  (via drill 0.33)
  Top 0.203: IC1.5 62.47,36.84 60.97,35.34 C5.1 61.04,33.13 v62.04,33.13 | v62.42,31.63 63.38,32.6 63.51,32.6 R10.2
  Bottom 0.203: v62.42,31.63 62.42,32.75 v62.04,33.13
N$22
  Top 0.203: T1.C 76.21,40.5 75.57,41.13 R19.2 75.52,42.43 74.76,43.19 74.76,44.71 74.96,44.92 77.55,44.92 79.43,43.04 79.69,43.04 T5.B
N$23
  Top 0.203: R28.2 85.73,17.94 85.58,18.09 T10.B
N$24
  Top 0.203: R20.2 73.67,34.78 77.15,38.26 T1.E
N$25
  Top 0.203: T9.E 77.66,18.09 80.42,15.32 80.42,15.25 R34.2 80.5,15.38 81.19,16.06 82,16.06 84.39,18.45 84.39,18.58 85.56,19.74 T10.E
N$26
  Top 0.203: R33.2 73.67,18.91 77.15,22.39 T7.E
N$27
  Top 0.203: R29.2 90.81,17.36 86.06,22.11 86.06,23.02 T8.E
N$28
  Top 0.203: D4.A 87.64,23.4 89.54,23.4 D5.C 89.34,23.33 89.34,20.33 R35.2
N$29
  Top 0.203: 85.1,42.99 83.55,42.99 83.52,43.01 T6.B | 85.1,42.99 86.37,42.99 R18.2 | 85.1,42.99 T2.C
N$30  (via drill 0.33)
  Top 0.203: v86.19,34.07 87.64,32.62 R17.2 | v83.68,37.02 83.68,37.8 84.13,38.26 T2.B
  Bottom 0.203: v86.19,34.07 86.19,34.5 v83.68,37.02
N$32
  Top 0.203: R13.1 76.21,35.09 77.63,36.51 T3.B
N$33
  Top 0.203: R12.1 73.03,38.51 75.01,38.51 75.24,38.29 T1.B
N$34
  Top 0.203: D8.C 64.78,47.76 65.97,47.76 66.05,47.84 R7.1
N$36
  Top 0.203: R14.2 85.1,34.45 84.95,34.6 T4.B
N$37  (via drill 0.33)
  Top 0.203: 82.15,33.36 82.15,32.01 R15.2 | 82.15,33.36 83.9,35.11 83.9,35.49 T4.E | v77.66,33.56 77.66,34.6 T3.E | v81.92,33.56 82.08,33.41 82.15,33.36
  Bottom 0.203: v81.92,33.56 v77.66,33.56
N$38
  Top 0.203: R16.2 90.18,33.23 86.06,37.35 86.06,38.26 T2.E
N$44
  Top 0.203: D2.A 87.64,38.01 89.54,38.01 D3.C 89.34,37.93 89.34,35.57 R21.2
N$46  (via drill 0.33)
  Top 0.203: R36.1 13.88,12.71 11.13,15.45 11.13,15.65 9.97,16.82 9.76,16.82 v8.85,17.74
  Bottom 0.203: v8.85,17.74 8.85,17.94 3.36,23.43 U$3.5
NORDIC_EN
  Bottom 0.203: U$2.3 10.17,16.42 11.74,17.99 11.74,21.52 25.76,35.54 40.52,35.54 40.98,35.09 40.98,32.72 U$1.6 JP1.6
PB5
  Top 0.203: JP2.9 U$1.21
PB6
  Top 0.203: JP2.8 U$1.22
PD6
  Top 0.203: JP2.12 U$1.18
PF4
  Top 0.203: JP2.4 U$1.26
PF5
  Top 0.203: JP2.5 U$1.25
RSSI  (via drill 0.33)
  Top 0.203: v6.76,14.03 6.76,7.63 R41.2
  Bottom 0.203: v6.76,14.03 6.76,14.36 3.41,17.71 3.41,20.35 2.35,21.42 U$3.6
RST
  Top 0.203: JP3.4 U$1.16
SPI_CLK  (via drill 0.33)
  Top 0.203: v31.73,33.64 JP1.3 U$1.3
  Bottom 0.203: U$2.5 13.88,15.25 14.84,14.28 15.65,14.28 23.27,21.9 23.27,31.89 25.03,33.64 v31.73,33.64
SPI_MISO
  Bottom 0.203: U$2.7 15.25,16.42 22.87,24.04 22.87,32.06 25.1,34.3 JP1.5 U$1.5
SPI_MOSI  (via drill 0.33)
  Top 0.203: U$2.6 12.05,17.79 v11.08,18.75
  Bottom 0.203: v11.08,18.75 11.08,21.45 26.48,36.84 JP1.4 U$1.4
SPI_SS
  Top 0.203: U$2.4 10.17,18.78 33.31,41.92 JP1.2 U$1.2
USART_CTS
  Top 0.203: JP1.8 U$1.8
  Bottom 0.203: JP1.8 33.79,26.68 29.24,22.13 29.24,20.81 24.37,15.93 24.37,15.45 U$3.12
USART_RTS
  Top 0.203: U$1.7 JP1.7 37.4,29.17 31.68,23.45 24.37,23.45 U$3.16
USART_RX  (via drill 0.33)
  Top 0.203: U$1.9 JP1.9 37.42,24.06 37.42,23.33 34.45,20.35 v34.45,18.4 | JP9.2 12.71,1.38 17.03,5.7 17.03,6.36 D11.C
  Bottom 0.203: U$3.2 2.32,29.42 2.32,28.94 1.25,27.87 1.25,12.73 JP9.2 12.78,1.33 13.98,2.52 15.73,2.52 31.61,18.4 v34.45,18.4
USART_TX  (via drill 0.33)
  Top 0.203: JP1.10 U$1.10 | 11.95,5.52 11.95,3.06 JP9.3 | 11.95,5.52 11.95,6.36 D13.C 11.87,6.13 8.8,9.2 8.8,15.83 8.42,16.21 7.83,16.21 6.66,17.38 6.66,23.1 2.35,27.42 U$3.3 | 11.95,5.52 v13.7,5.52
  Bottom 0.203: JP1.10 32.27,21.6 30.97,20.3 29.96,20.3 25.43,15.78 25.43,13.01 17.94,5.52 v13.7,5.52
VCC  (via drill 0.33)
  Top 0.203: 67.78,9.76 74.94,9.76 R5.1 74.99,9.81 77.88,12.71 C3.1 77.99,12.66 79,11.64 v79.51,11.64 | 67.78,9.76 65.11,9.76 62.59,12.28 62.24,12.28 R2.1 62.19,12.2 v55.28,5.29 | IC2.14 68.21,25.41 v67.6,24.8 | v67.6,13.5 67.6,12.23 67.78,12.05 67.78,9.76 | v70.04,42.81 69.2,41.97 IC1.14 | U$1.14 JP3.2 45.14,13.9 52.08,6.97 JP4.5 | JP2.1 U$1.29 | JP5.5 52.08,47.66 55.2,44.53 U$1.29 | R8.2 51.24,31.76 51.24,29.22 R22.2 51.24,29.14 51.24,21.67 R9.2 51.24,21.6 51.24,19.06 R23.2 51.14,19.01 48.37,19.01 45.93,16.57 45.17,16.57 U$1.14 | 50.58,33.1 50.58,32.42 51.16,31.83 R8.2 | U$1.29 55.25,43.67 51.9,40.32 51.9,32.75 51.14,31.99 R8.2 | U$1.14 45.02,16.57 43.82,17.76 43.75,17.81 42.43,19.13 41.87,19.13 40.55,17.81 36.99,17.81 36.56,17.38 34.53,17.38 30.46,21.45 JP12.1 27.95,19.06 R1.1 27.87,13.5 25.92,13.5 24.77,12.35 18.7,12.35 R36.2 18.63,12.71 18.63,9.33 17,7.7 R39.2 | JP10.1 2.32,37.07 2.32,31.45 U$3.1 2.4,31.35 2.4,30.89 7.58,25.71 7.58,17.86 U$2.2 7.63,17.59 9.2,16.01 9.2,12 13.5,7.7 R40.2 R39.2 | JP9.1 15.25,3.34 17.76,5.85 17.76,6.87 17.03,7.6 R39.2
  Bottom 0.203: v67.6,13.5 v67.6,24.8 | D7.C 82.94,11.44 81.77,12.61 80.48,12.61 v79.51,11.64 | JP11.1 86.88,49.54 80.15,42.81 71.69,42.81 | v70.04,42.81 71.69,42.81 | v55.28,5.29 55.28,4.48 JP4.5 | 71.69,42.81 71.69,49.92 71.51,50.1 63.43,50.1 JP2.1
VIN  (via drill 0.33)
  Top 0.254: 75.57,8.03 77.48,8.03 77.88,7.63 C1.1 77.88,7.81 77.88,8.9 | 75.57,8.03 74.94,8.03 R5.2 | 77.88,8.9 77.88,10.17 C2.1 | 75.57,8.03 C4.+ | 77.88,8.9 D1.C | 77.88,28.23 77.88,27.24 77.81,27.16 T11.E 77.86,27.03 v77.86,23.86 | 77.88,28.23 77.88,29.22 R32.1 77.96,29.32 77.96,32.9 78.8,33.74 78.8,38.92 79.59,39.71 79.59,41.97 | 81.69,28.23 81.69,27.24 81.62,27.16 T12.E | 81.69,28.23 81.69,29.22 R31.1 | 81.69,28.23 77.88,28.23 | R19.1 75.57,44.03 76.79,44.03 77.78,43.04 T5.E 77.91,42.96 78.09,42.96 79.08,41.97 79.59,41.97 | R18.1 83.24,44.66 81.62,43.04 T6.E 81.52,42.93 80.55,41.97 79.59,41.97
  Bottom 0.254: D1.C 77.86,12.33 v77.86,23.86

### Text on the board
tNames: DIR_L | DIR_R | EN_L | EN_R | VCC | GND | GND | 3.3V | CONTROL | GND | 3.3V | M1 OUTPUT | WIRELESS INF / / XBEE MODULE / & / NORDIC 2.4GHZ | 3.3V | GND | M2 OUTPUT | RSSI | RX | TX | GND | TX | RX | VCC | DIR_L | DIR_R | EN_L | EN_R | VCC | GND | GND | VIN | VIN | GND | FTDI / HEADER